# EAGLE design TPS63000-Breakout (EAGLE 7.6.0)
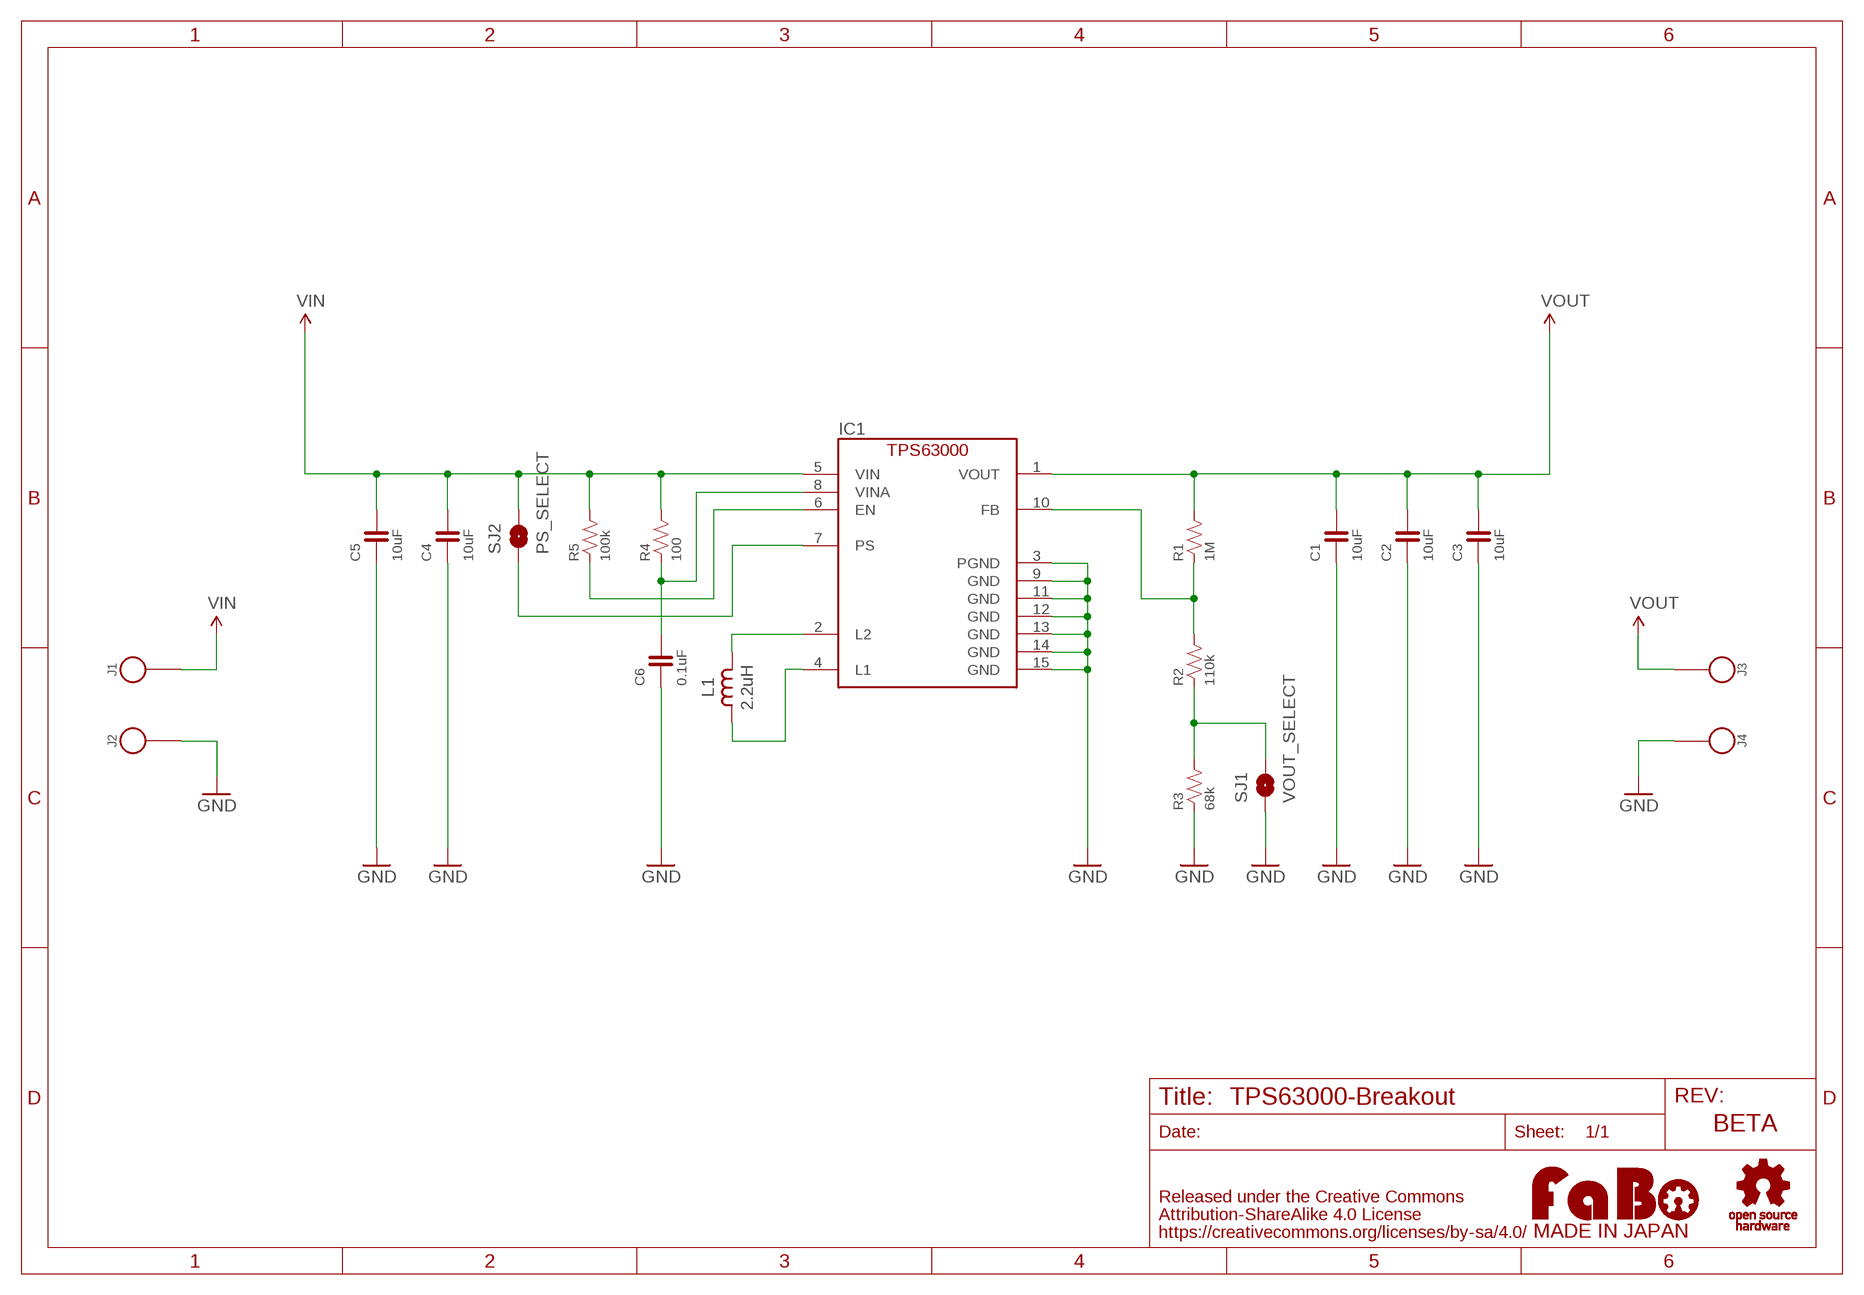
[diagram p0: schematic, sheet 1]

## Parts
C1  10uF  CAPACITOR-0603_NARROW  [0603-NARROW]
C2  10uF  CAPACITOR-0603_NARROW  [0603-NARROW]
C3  10uF  CAPACITOR-0603_NARROW  [0603-NARROW]
C4  10uF  CAPACITOR-0603_NARROW  [0603-NARROW]
C5  10uF  CAPACITOR-0603_NARROW  [0603-NARROW]
C6  0.1uF  CAPACITOR-0603_NARROW  [0603-NARROW]
IC1  TPS63000DRC  [VSON-10]
J1  PIN_HEADER_1X1_NOLABEL  [PIN_1X1_NOLABEL]
J2  PIN_HEADER_1X1_NOLABEL  [PIN_1X1_NOLABEL]
J3  PIN_HEADER_1X1_NOLABEL  [PIN_1X1_NOLABEL]
J4  PIN_HEADER_1X1_NOLABEL  [PIN_1X1_NOLABEL]
L1  2.2uH  INDUCTOR-LQH3NPN  [LQH3NPN]
R1  1M  RESISTOR-0603-NARROW  [0603-NARROW]
R2  110k  RESISTOR-0603-NARROW  [0603-NARROW]
R3  68k  RESISTOR-0603-NARROW  [0603-NARROW]
R4  100  RESISTOR-0603-NARROW  [0603-NARROW]
R5  100k  RESISTOR-0603-NARROW  [0603-NARROW]
SJ1  VOUT_SELECT  SMD-JUMPER-2-SHORT  [SMD-JUMPER-2-SHORT]
SJ2  PS_SELECT  SMD-JUMPER-2-SHORT  [SMD-JUMPER-2-SHORT]
U$2  LOGO_OSHW-M_BOTTOM  [LOGO_OSHW_M_BOTTOM]
U$3  LOGO_FABO-M_BOTTOM  [LOGO_FABO_MS_BOTTOM]

## Nets
EN: IC1.6(EN) R5.1
FB: IC1.10(FB) R1.1 R2.2
GND: C1.1 C2.1 C3.1 C4.1 C5.1 C6.1 IC1.3(PGND) IC1.9(GND) IC1.11(GND) IC1.12(GND) IC1.13(GND) IC1.14(GND) IC1.15(GND) J2.1 J4.1 R3.1 SJ1.2
L1: IC1.4(L1) L1.1
L2: IC1.2(L2) L1.2
N$2: R2.1 R3.2 SJ1.1
PS: IC1.7(PS) SJ2.2
VIN: C4.2 C5.2 IC1.5(VIN) J1.1 R4.2 R5.2 SJ2.1
VINA: C6.2 IC1.8(VINA) R4.1
VOUT: C1.2 C2.2 C3.2 IC1.1(VOUT) J3.1 R1.2

## Notes on the sheet
- BETA

## Library data of the parts
C1-C6 = FaBo-Capacitor:CAPACITOR: CAPACITOR
IC1 = FaBo-Supply:TPS63000
J1-J4 = FaBo-PIN:PIN_HEADER_1X1_NOLABEL
L1 = FaBo-Parts:INDUCTOR
R1-R5 = FaBo-Resistors:RESISTOR: RESISTOR
SJ1 SJ2 = FaBo-Supply:SMD-JUMPER-2
U$2 = FaBo-Logo:LOGO_OSHW
U$3 = FaBo-Logo:LOGO_FABO

## Board
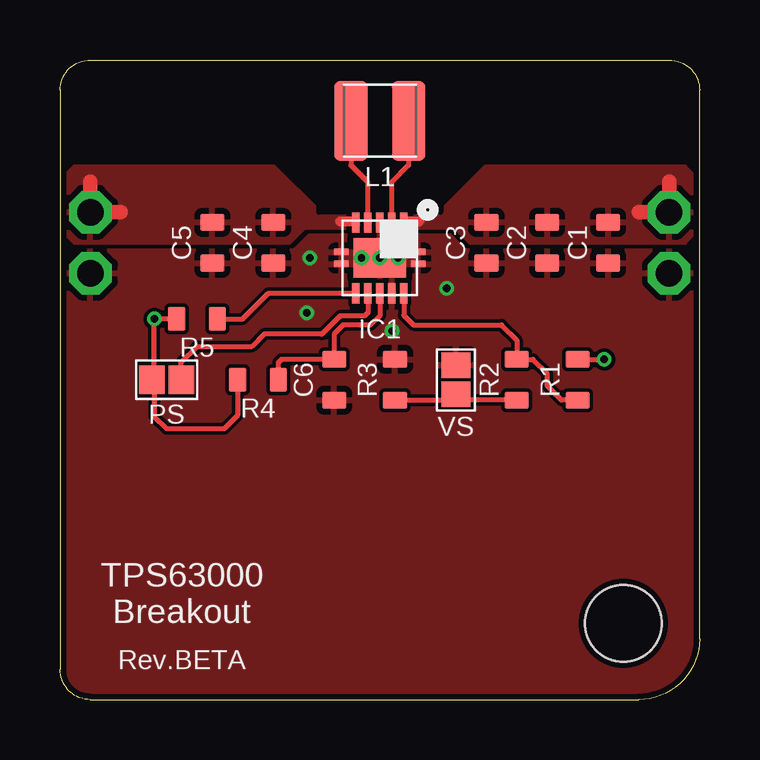
[diagram p1: board, top side]
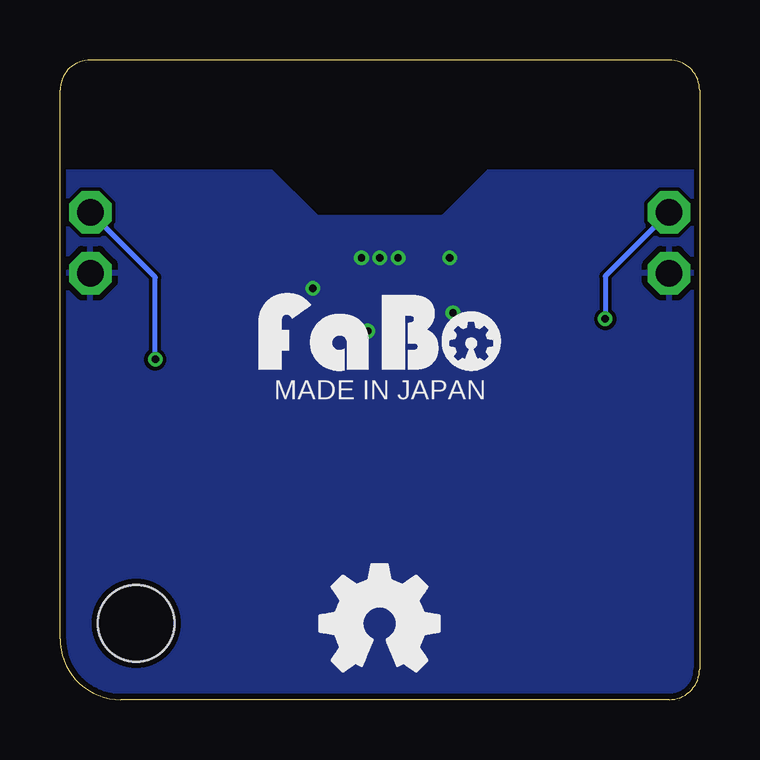
[diagram p2: board, bottom side, seen from below]

Size 26.67 x 26.67 mm. Coordinates in mm from the lower left corner, seen from the top.
Outline: 26.67,2.54 26.67,25.4 arc90 25.4,26.67 1.27,26.67 arc90 0,25.4 0,1.27 arc90 1.27,0 24.13,0 arc90 26.67,2.54
Copper layers (1*16): Top 0.035mm / dielectric 1.5mm / Bottom 0.035mm
Design rules "Elecrow_angle": minimum track width 6mil, minimum drill 12mil, track to track 6mil, track to pad 6mil, pad to pad 6mil, via to via 6mil, smd to smd 0mil, copper to edge 10mil, drill to drill 10mil, minimum pad ring 10mil, minimum via ring 6mil, stop-mask expansion 2mil, vias tented up to drill 100mil, thermal gap 10mil
Holes 3.2 mm at 23.5,3.17
tRestrict: area 10.8,20.3 to 15.9,26.7
bRestrict: area 0,20.3 to 26.7,26.7

### Footprints (pad centres in the part's own frame; a part is rotated, then mirrored left to right if it is on the bottom)
0603-NARROW = smd 0.71 x 1: 1 -0.85,0; 2 0.85,0
VSON-10 = smd 0.3 x 0.85: 1 -1,-1.475; 2 -0.5,-1.475; 3 0,-1.475; 4 0.5,-1.475; 5 1,-1.475; 6 1,1.475; 7 0.5,1.475; 8 0,1.475; 9 -0.5,1.475; 10 -1,1.475 | smd 2.2 x 1.65: 11 0,0 | smd 0.6 x 0.28: 12 1.6,-0.25; 13 1.6,0.25; 14 -1.6,0.25; 15 -1.6,-0.25
PIN_1X1_NOLABEL = drill 1.1 pad 1.778 octagon: 1 0,0
LQH3NPN = smd 1.4 x 3.3: 1 -1.2,0; 2 1.2,0
SMD-JUMPER-2-SHORT = smd 1.067 x 1.2: 1 -0.61,0; 2 0.61,0

### Placement (x,y rotation side)
C1  22.86,19.05 90 top
C2  20.32,19.05 90 top
C3  17.78,19.05 90 top
C4  8.89,19.05 90 top
C5  6.35,19.05 90 top
C6  11.43,13.34 90 top
IC1  13.34,18.41 180 top
J1  1.27,20.32 0 top
J2  1.27,17.78 0 top
J3  25.4,20.32 0 top
J4  25.4,17.78 0 top
L1  13.34,24.13 0 top
R1  21.59,13.34 90 top
R2  19.05,13.34 90 top
R3  13.97,13.34 270 top
R4  8.26,13.34 180 top
R5  5.71,15.88 180 top
SJ1  16.51,13.34 90 top
SJ2  4.45,13.34 0 top
U$2  13.34,3.17 0 top
U$3  13.34,13.34 0 top

### Tracks (layer width: path | path; a pad name or v marks a point on that pad's centre or on a via)
EN
  Top 0.203: R5.1 7.62,15.88 8.69,16.94 IC1.6
FB
  Top 0.203: R1.1 20.92,12.48 20.32,13.08 20.32,13.59 19.72,14.19 R2.2 19.05,14.99 18.41,15.62 14.73,15.62 14.34,16.02 IC1.10
GND  (via drill 0.3)
  other vias: 13.34,18.41 12.57,18.41 14.1,18.41 13.84,15.37 16.13,17.14 10.41,18.41 10.29,16.13
  pour Top (rank 2): 0,26.67 26.67,26.67 26.67,0 0,0
  pour Bottom (rank 2): 0,26.67 26.67,26.67 26.67,0 0,0
L1
  Top 0.203: L1.1 12.13,22.28 12.84,21.58 IC1.4
L2
  Top 0.203: L1.2 14.54,22.28 13.84,21.58 IC1.2
N$2
  Top 0.203: R2.1 16.51,12.48 | R3.2 16.51,12.48 | 16.51,12.48 SJ1.1
PS
  Top 0.203: IC1.7 12.84,16.14 12.7,16 11.68,16 10.92,15.24 8.51,15.24 8,14.73 5.71,14.73 5.05,14.07 SJ2.2
VIN  (via drill 0.3)
  Top 0.203: R5.2 v3.94,15.88 3.94,13.44 | SJ2.1 3.94,13.44 | 3.94,13.44 3.94,11.81 4.45,11.3 6.86,11.3 7.41,11.85 R4.2
  Top 0.406: 12.19,19.94 11.68,19.94
  Top 0.61: 2.54,20.32 J1.1 1.27,21.59
  Bottom 0.203: J1.1 3.94,17.65 v3.94,15.88
  pour Top: 12.7,19.68 10.16,19.68 9.53,19.05 0.64,19.05 0,19.68 0,21.59 0.64,22.23 8.89,22.23 10.79,20.32 12.7,20.32
VINA
  Top 0.203: IC1.8 13.34,16 12.95,15.62 11.81,15.62 11.43,15.24 C6.2 9.23,14.19 9.11,14.06 R4.1
VOUT  (via drill 0.3)
  Top 0.203: R1.2 v22.69,14.19
  Top 0.406: 14.99,19.94 14.48,19.94
  Top 0.61: 24.13,20.32 J3.1 25.4,21.59
  Bottom 0.203: J3.1 22.69,17.61 v22.69,14.19
  pour Top: 26.04,19.05 17.14,19.05 16.51,19.68 13.97,19.68 13.97,20.32 15.88,20.32 17.78,22.23 26.04,22.23 26.67,21.59 26.67,19.68

### Text on the board
tPlace: PS | VS | TPS63000 / Breakout | Rev.BETA
bPlace: MADE IN JAPAN